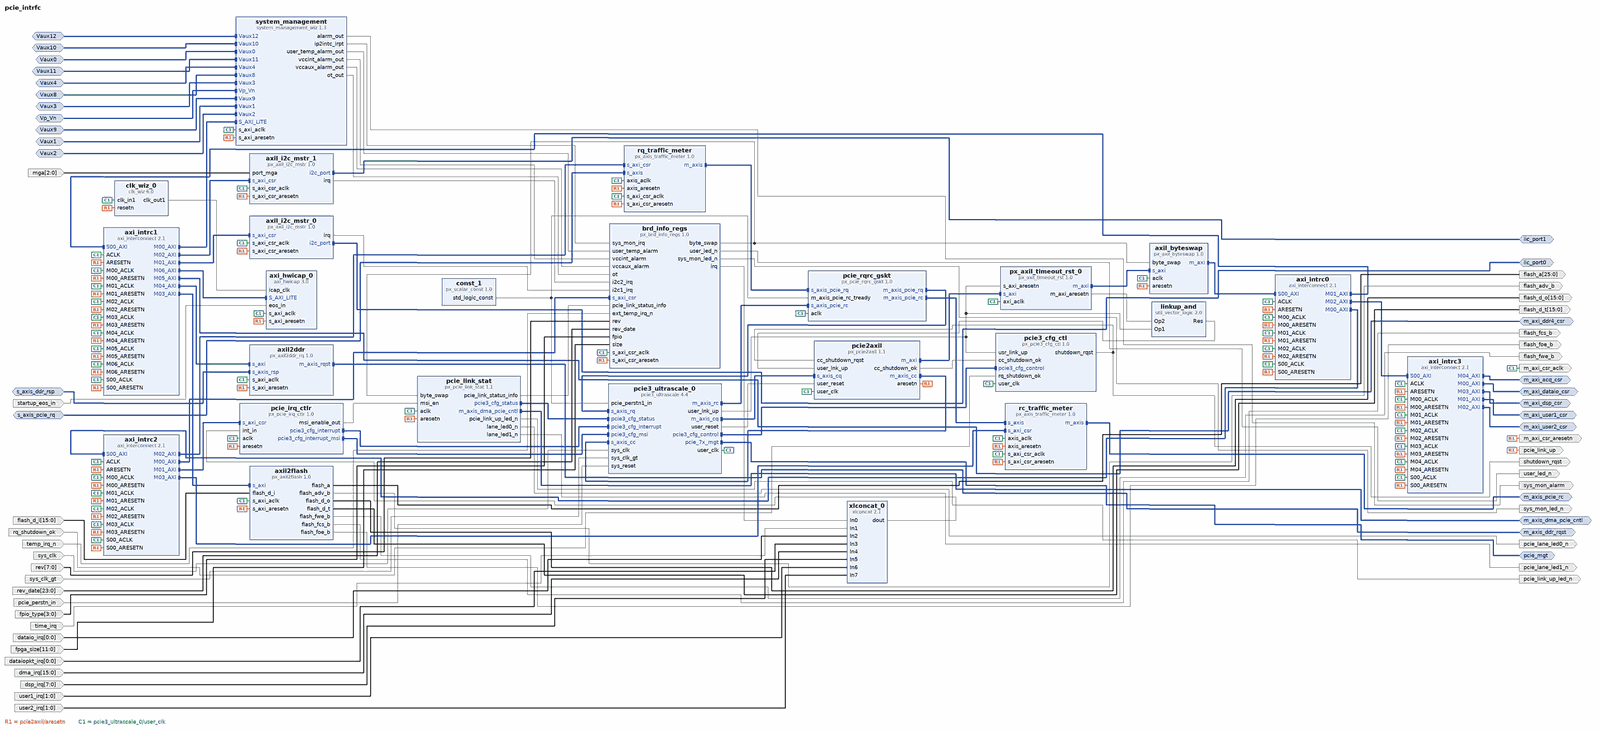
[diagram p0: block diagram of the top level, whole]
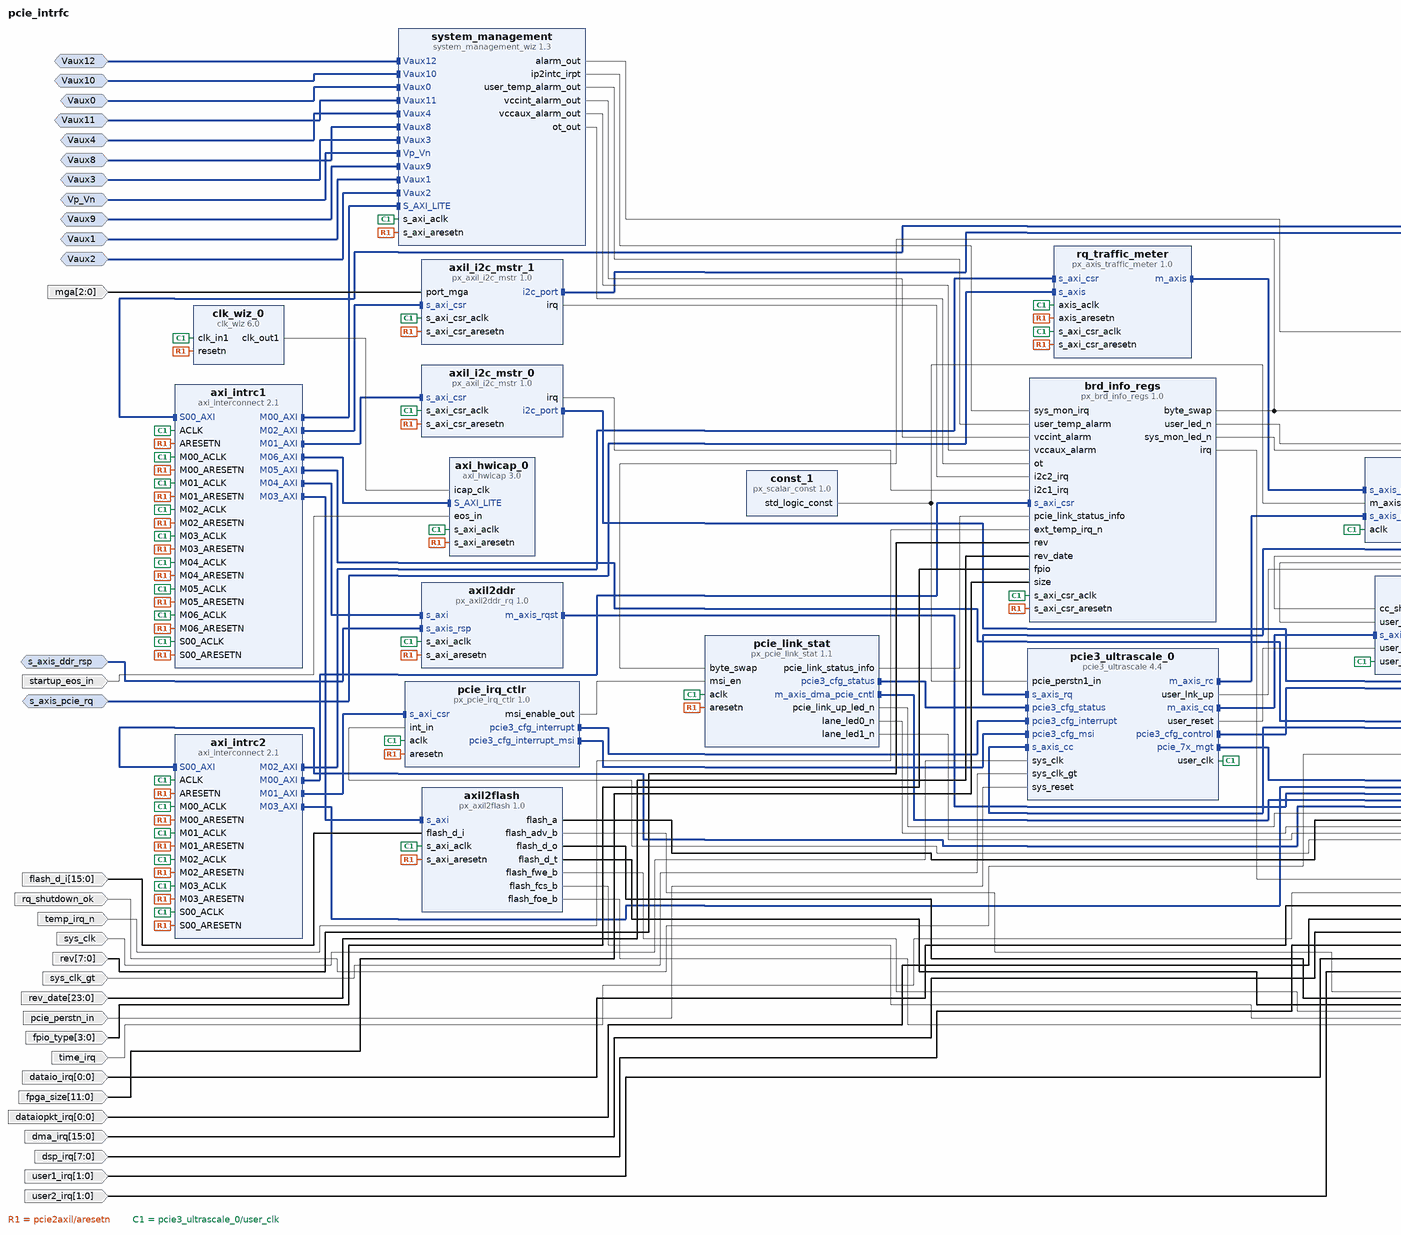
[diagram p1: block diagram of the top level, left part]
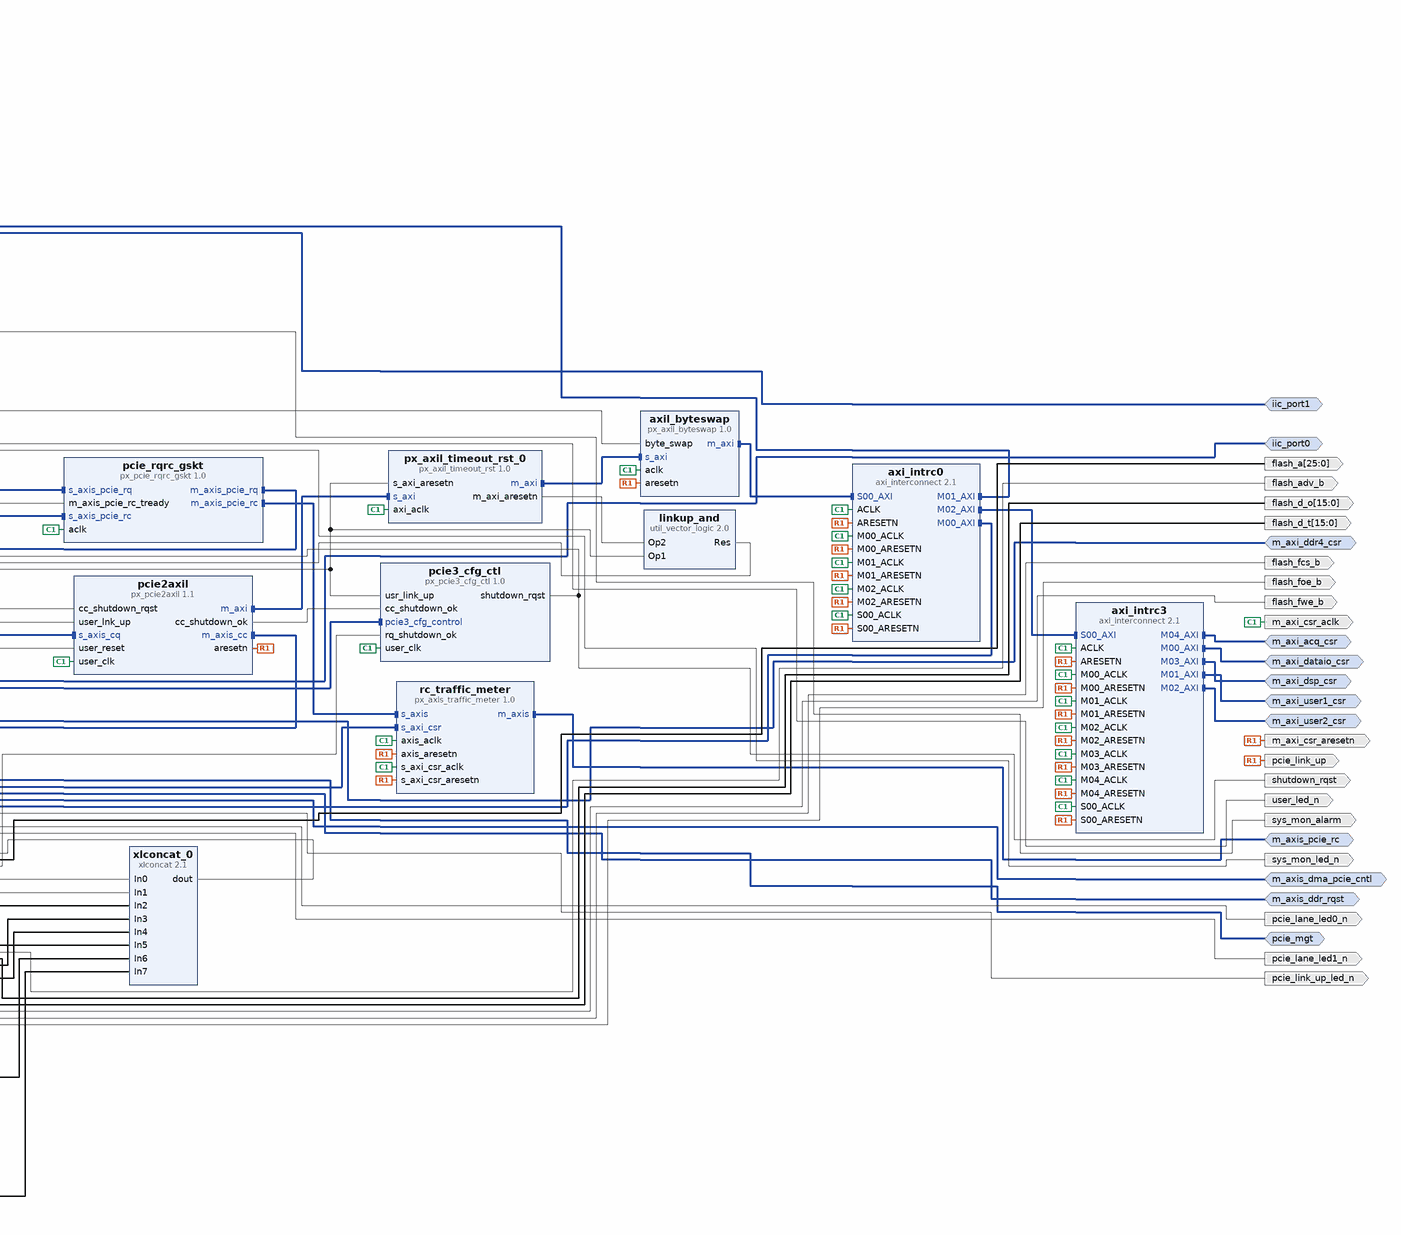
[diagram p2: block diagram of the top level, right part]
# Vivado block design pcie_intrfc, xcku060-ffva1156-2-e, Vivado 2019.2
create_bd_design pcie_intrfc

create_bd_intf_port -mode Slave -vlnv xilinx.com:interface:axis_rtl:1.0 s_axis_pcie_rq
set_property -dict [list \
  CONFIG.TDATA_NUM_BYTES 32 \
  CONFIG.TDEST_WIDTH 0 \
  CONFIG.TID_WIDTH 0 \
  CONFIG.TUSER_WIDTH 60 \
  CONFIG.HAS_TREADY 1 \
  CONFIG.HAS_TSTRB 0 \
  CONFIG.HAS_TKEEP 1 \
  CONFIG.HAS_TLAST 1 \
  CONFIG.LAYERED_METADATA undef \
] [get_bd_intf_ports s_axis_pcie_rq]
create_bd_intf_port -mode Master -vlnv xilinx.com:interface:pcie_7x_mgt_rtl:1.0 pcie_mgt
create_bd_intf_port -mode Slave -vlnv xilinx.com:interface:diff_analog_io_rtl:1.0 Vp_Vn
create_bd_intf_port -mode Slave -vlnv xilinx.com:interface:diff_analog_io_rtl:1.0 Vaux0
create_bd_intf_port -mode Slave -vlnv xilinx.com:interface:diff_analog_io_rtl:1.0 Vaux1
create_bd_intf_port -mode Slave -vlnv xilinx.com:interface:diff_analog_io_rtl:1.0 Vaux2
create_bd_intf_port -mode Slave -vlnv xilinx.com:interface:diff_analog_io_rtl:1.0 Vaux3
create_bd_intf_port -mode Slave -vlnv xilinx.com:interface:diff_analog_io_rtl:1.0 Vaux4
create_bd_intf_port -mode Slave -vlnv xilinx.com:interface:diff_analog_io_rtl:1.0 Vaux8
create_bd_intf_port -mode Slave -vlnv xilinx.com:interface:diff_analog_io_rtl:1.0 Vaux9
create_bd_intf_port -mode Slave -vlnv xilinx.com:interface:diff_analog_io_rtl:1.0 Vaux10
create_bd_intf_port -mode Slave -vlnv xilinx.com:interface:diff_analog_io_rtl:1.0 Vaux11
create_bd_intf_port -mode Slave -vlnv xilinx.com:interface:diff_analog_io_rtl:1.0 Vaux12
create_bd_intf_port -mode Master -vlnv xilinx.com:interface:iic_rtl:1.0 iic_port0
create_bd_intf_port -mode Master -vlnv xilinx.com:interface:iic_rtl:1.0 iic_port1
create_bd_intf_port -mode Master -vlnv xilinx.com:interface:axis_rtl:1.0 m_axis_dma_pcie_cntl
create_bd_intf_port -mode Master -vlnv xilinx.com:interface:aximm_rtl:1.0 m_axi_dataio_csr
set_property -dict [list \
  CONFIG.DATA_WIDTH 32 \
  CONFIG.PROTOCOL AXI4LITE \
  CONFIG.ADDR_WIDTH 26 \
  CONFIG.NUM_READ_OUTSTANDING 1 \
  CONFIG.NUM_WRITE_OUTSTANDING 1 \
] [get_bd_intf_ports m_axi_dataio_csr]
create_bd_intf_port -mode Master -vlnv xilinx.com:interface:aximm_rtl:1.0 m_axi_user1_csr
set_property -dict [list \
  CONFIG.DATA_WIDTH 32 \
  CONFIG.PROTOCOL AXI4LITE \
  CONFIG.ADDR_WIDTH 26 \
  CONFIG.NUM_READ_OUTSTANDING 1 \
  CONFIG.NUM_WRITE_OUTSTANDING 1 \
] [get_bd_intf_ports m_axi_user1_csr]
create_bd_intf_port -mode Master -vlnv xilinx.com:interface:aximm_rtl:1.0 m_axi_user2_csr
set_property -dict [list \
  CONFIG.DATA_WIDTH 32 \
  CONFIG.PROTOCOL AXI4LITE \
  CONFIG.ADDR_WIDTH 26 \
  CONFIG.NUM_READ_OUTSTANDING 1 \
  CONFIG.NUM_WRITE_OUTSTANDING 1 \
] [get_bd_intf_ports m_axi_user2_csr]
create_bd_intf_port -mode Master -vlnv xilinx.com:interface:aximm_rtl:1.0 m_axi_dsp_csr
set_property -dict [list \
  CONFIG.DATA_WIDTH 32 \
  CONFIG.PROTOCOL AXI4LITE \
  CONFIG.ADDR_WIDTH 26 \
  CONFIG.NUM_READ_OUTSTANDING 1 \
  CONFIG.NUM_WRITE_OUTSTANDING 1 \
] [get_bd_intf_ports m_axi_dsp_csr]
create_bd_intf_port -mode Master -vlnv xilinx.com:interface:aximm_rtl:1.0 m_axi_acq_csr
set_property -dict [list \
  CONFIG.DATA_WIDTH 32 \
  CONFIG.PROTOCOL AXI4LITE \
  CONFIG.ADDR_WIDTH 26 \
  CONFIG.NUM_READ_OUTSTANDING 1 \
  CONFIG.NUM_WRITE_OUTSTANDING 1 \
] [get_bd_intf_ports m_axi_acq_csr]
create_bd_intf_port -mode Master -vlnv xilinx.com:interface:axis_rtl:1.0 m_axis_ddr_rqst
create_bd_intf_port -mode Slave -vlnv xilinx.com:interface:axis_rtl:1.0 s_axis_ddr_rsp
set_property -dict [list \
  CONFIG.TDATA_NUM_BYTES 64 \
  CONFIG.TDEST_WIDTH 0 \
  CONFIG.TID_WIDTH 8 \
  CONFIG.TUSER_WIDTH 256 \
  CONFIG.HAS_TREADY 0 \
  CONFIG.HAS_TSTRB 0 \
  CONFIG.HAS_TKEEP 0 \
  CONFIG.HAS_TLAST 1 \
  CONFIG.LAYERED_METADATA undef \
] [get_bd_intf_ports s_axis_ddr_rsp]
create_bd_intf_port -mode Master -vlnv xilinx.com:interface:aximm_rtl:1.0 m_axi_ddr4_csr
set_property -dict [list \
  CONFIG.DATA_WIDTH 32 \
  CONFIG.PROTOCOL AXI4LITE \
  CONFIG.ADDR_WIDTH 26 \
  CONFIG.NUM_READ_OUTSTANDING 1 \
  CONFIG.NUM_WRITE_OUTSTANDING 1 \
] [get_bd_intf_ports m_axi_ddr4_csr]
create_bd_intf_port -mode Master -vlnv xilinx.com:interface:axis_rtl:1.0 m_axis_pcie_rc
create_bd_port -dir O pcie_link_up
create_bd_port -dir O -type rst m_axi_csr_aresetn
create_bd_port -dir O shutdown_rqst
create_bd_port -dir I rq_shutdown_ok
create_bd_port -dir O -type clk m_axi_csr_aclk
set_property -dict [list \
  CONFIG.ASSOCIATED_BUSIF s_axis_pcie_rq:m_axis_dma_pcie_cntl:m_axi_dataio_csr:m_axi_user1_csr:m_axi_user2_csr:m_axi_dsp_csr:m_axi_acq_csr:s_axis_ddr_rsp:m_axis_ddr_rqst:m_axi_ddr4_csr:m_axis_pcie_rc \
] [get_bd_ports m_axi_csr_aclk]
create_bd_port -dir I -type clk sys_clk
set_property -dict {CONFIG.FREQ_HZ 50000000} [get_bd_ports sys_clk]
create_bd_port -dir I -type clk sys_clk_gt
set_property -dict {CONFIG.FREQ_HZ 100000000} [get_bd_ports sys_clk_gt]
create_bd_port -dir I -type rst pcie_perstn_in
create_bd_port -dir O sys_mon_alarm
create_bd_port -dir I -from 2 -to 0 mga
create_bd_port -dir O pcie_link_up_led_n
create_bd_port -dir O pcie_lane_led0_n
create_bd_port -dir O pcie_lane_led1_n
create_bd_port -dir O user_led_n
create_bd_port -dir O sys_mon_led_n
create_bd_port -dir I -type intr temp_irq_n
set_property -dict {CONFIG.SENSITIVITY LEVEL_LOW} [get_bd_ports temp_irq_n]
create_bd_port -dir I -from 7 -to 0 rev
create_bd_port -dir I -from 23 -to 0 rev_date
create_bd_port -dir I -from 3 -to 0 fpio_type
create_bd_port -dir I time_irq
create_bd_port -dir I -from 0 -to 0 dataio_irq
create_bd_port -dir I -from 0 -to 0 dataiopkt_irq
create_bd_port -dir I -from 15 -to 0 dma_irq
create_bd_port -dir I -from 7 -to 0 dsp_irq
create_bd_port -dir I -from 1 -to 0 user1_irq
create_bd_port -dir I -from 1 -to 0 user2_irq
create_bd_port -dir O -from 25 -to 0 flash_a
create_bd_port -dir O flash_adv_b
create_bd_port -dir O -from 15 -to 0 flash_d_o
create_bd_port -dir O -from 15 -to 0 flash_d_t
create_bd_port -dir O flash_fwe_b
create_bd_port -dir O flash_fcs_b
create_bd_port -dir O flash_foe_b
create_bd_port -dir I -from 15 -to 0 flash_d_i
create_bd_port -dir I -from 11 -to 0 fpga_size
create_bd_port -dir I startup_eos_in

create_bd_cell -type ip -vlnv xilinx.com:ip:util_vector_logic:2.0 linkup_and
set_property -dict {CONFIG.C_SIZE 1} [get_bd_cells linkup_and]
create_bd_cell -type ip -vlnv xilinx.com:ip:xlconcat:2.1 xlconcat_0
set_property -dict [list \
  CONFIG.IN0_WIDTH 1 \
  CONFIG.IN1_WIDTH 1 \
  CONFIG.IN2_WIDTH 1 \
  CONFIG.IN3_WIDTH 1 \
  CONFIG.IN4_WIDTH 16 \
  CONFIG.IN5_WIDTH 8 \
  CONFIG.IN6_WIDTH 2 \
  CONFIG.IN7_WIDTH 2 \
  CONFIG.NUM_PORTS 8 \
  CONFIG.dout_width 32 \
] [get_bd_cells xlconcat_0]
create_bd_cell -type ip -vlnv xilinx.com:ip:axi_hwicap:3.0 axi_hwicap_0
create_bd_cell -type ip -vlnv xilinx.com:ip:axi_interconnect:2.1 axi_intrc0
set_property -dict [list \
  CONFIG.M00_HAS_REGSLICE 3 \
  CONFIG.M01_HAS_REGSLICE 3 \
  CONFIG.M02_HAS_REGSLICE 1 \
  CONFIG.NUM_MI 3 \
  CONFIG.S00_HAS_REGSLICE 1 \
  CONFIG.SYNCHRONIZATION_STAGES 2 \
] [get_bd_cells axi_intrc0]
create_bd_cell -type ip -vlnv xilinx.com:ip:axi_interconnect:2.1 axi_intrc2
set_property -dict [list \
  CONFIG.M00_HAS_REGSLICE 3 \
  CONFIG.M01_HAS_REGSLICE 3 \
  CONFIG.M02_HAS_REGSLICE 3 \
  CONFIG.M03_HAS_REGSLICE 3 \
  CONFIG.NUM_MI 4 \
  CONFIG.S00_HAS_REGSLICE 1 \
  CONFIG.SYNCHRONIZATION_STAGES 2 \
] [get_bd_cells axi_intrc2]
create_bd_cell -type ip -vlnv xilinx.com:ip:axi_interconnect:2.1 axi_intrc1
set_property -dict [list \
  CONFIG.M00_HAS_REGSLICE 3 \
  CONFIG.M01_HAS_REGSLICE 3 \
  CONFIG.M02_HAS_REGSLICE 3 \
  CONFIG.M03_HAS_REGSLICE 3 \
  CONFIG.M04_HAS_REGSLICE 3 \
  CONFIG.M05_HAS_REGSLICE 3 \
  CONFIG.M06_HAS_REGSLICE 3 \
  CONFIG.NUM_MI 7 \
  CONFIG.S00_HAS_REGSLICE 1 \
  CONFIG.SYNCHRONIZATION_STAGES 2 \
] [get_bd_cells axi_intrc1]
create_bd_cell -type ip -vlnv xilinx.com:ip:axi_interconnect:2.1 axi_intrc3
set_property -dict [list \
  CONFIG.M00_HAS_REGSLICE 3 \
  CONFIG.M01_HAS_REGSLICE 3 \
  CONFIG.M02_HAS_REGSLICE 3 \
  CONFIG.M03_HAS_REGSLICE 3 \
  CONFIG.M04_HAS_REGSLICE 3 \
  CONFIG.NUM_MI 5 \
  CONFIG.S00_HAS_REGSLICE 1 \
  CONFIG.SYNCHRONIZATION_STAGES 2 \
] [get_bd_cells axi_intrc3]
create_bd_cell -type ip -vlnv xilinx.com:ip:clk_wiz:6.0 clk_wiz_0
set_property -dict [list \
  CONFIG.CLKIN1_JITTER_PS 40.0 \
  CONFIG.CLKOUT1_DRIVES BUFGCE \
  CONFIG.CLKOUT1_JITTER 198.840 \
  CONFIG.CLKOUT1_PHASE_ERROR 145.783 \
  CONFIG.CLKOUT1_REQUESTED_OUT_FREQ 62.5 \
  CONFIG.CLKOUT2_DRIVES BUFGCE \
  CONFIG.CLKOUT3_DRIVES BUFGCE \
  CONFIG.CLKOUT4_DRIVES BUFGCE \
  CONFIG.CLKOUT5_DRIVES BUFGCE \
  CONFIG.CLKOUT6_DRIVES BUFGCE \
  CONFIG.CLKOUT7_DRIVES BUFGCE \
  CONFIG.FEEDBACK_SOURCE FDBK_AUTO \
  CONFIG.JITTER_SEL No_Jitter \
  CONFIG.MMCM_CLKFBOUT_MULT_F 9.625 \
  CONFIG.MMCM_CLKIN1_PERIOD 4.000 \
  CONFIG.MMCM_CLKIN2_PERIOD 10.0 \
  CONFIG.MMCM_CLKOUT0_DIVIDE_F 9.625 \
  CONFIG.MMCM_CLKOUT0_DUTY_CYCLE 0.5 \
  CONFIG.MMCM_DIVCLK_DIVIDE 4 \
  CONFIG.PRIM_IN_FREQ 250 \
  CONFIG.RESET_PORT resetn \
  CONFIG.RESET_TYPE ACTIVE_LOW \
  CONFIG.SECONDARY_SOURCE Single_ended_clock_capable_pin \
  CONFIG.USE_LOCKED false \
  CONFIG.USE_MIN_POWER true \
  CONFIG.USE_PHASE_ALIGNMENT false \
  CONFIG.USE_SAFE_CLOCK_STARTUP true \
] [get_bd_cells clk_wiz_0]
create_bd_cell -type ip -vlnv xilinx.com:ip:pcie3_ultrascale:4.4 pcie3_ultrascale_0
set_property -dict [list \
  CONFIG.AXISTEN_IF_RC_STRADDLE false \
  CONFIG.INS_LOSS_NYQ 15 \
  CONFIG.PF0_DEVICE_ID 7182 \
  CONFIG.PF0_MSIX_CAP_PBA_BIR BAR_1:0 \
  CONFIG.PF0_MSIX_CAP_TABLE_BIR BAR_1:0 \
  CONFIG.PF0_SUBSYSTEM_ID 300 \
  CONFIG.PF1_DEVICE_ID 8011 \
  CONFIG.PF1_MSIX_CAP_PBA_BIR BAR_0 \
  CONFIG.PF1_MSIX_CAP_TABLE_BIR BAR_0 \
  CONFIG.PL_LINK_CAP_MAX_LINK_SPEED 8.0_GT/s \
  CONFIG.PL_LINK_CAP_MAX_LINK_WIDTH X8 \
  CONFIG.REF_CLK_FREQ 100_MHz \
  CONFIG.alignment_mode Address_Aligned \
  CONFIG.aspm_support No_ASPM \
  CONFIG.axisten_freq 250 \
  CONFIG.axisten_if_width 256_bit \
  CONFIG.cfg_ext_if false \
  CONFIG.cfg_fc_if false \
  CONFIG.cfg_mgmt_if false \
  CONFIG.cfg_tx_msg_if false \
  CONFIG.coreclk_freq 500 \
  CONFIG.enable_auto_rxeq True \
  CONFIG.ins_loss_profile Add-in_Card \
  CONFIG.mode_selection Advanced \
  CONFIG.mult_pf_des false \
  CONFIG.per_func_status_if false \
  CONFIG.pf0_bar0_64bit true \
  CONFIG.pf0_bar0_scale Megabytes \
  CONFIG.pf0_bar0_size 64 \
  CONFIG.pf0_base_class_menu Data_acquisition_and_signal_processing_controllers \
  CONFIG.pf0_sub_class_interface_menu Other_data_acquisition/signal_processing_controllers \
  CONFIG.pf1_base_class_menu Simple_communication_controllers \
  CONFIG.pf1_sub_class_interface_menu Generic_XT_compatible_serial_controller \
  CONFIG.plltype QPLL1 \
  CONFIG.rcv_msg_if false \
  CONFIG.tx_fc_if false \
  CONFIG.vendor_id 12f0 \
] [get_bd_cells pcie3_ultrascale_0]
create_bd_cell -type ip -vlnv pentek.com:px_ip:px_axil2ddr_rq:1.0 axil2ddr
set_property -dict {CONFIG.has_irq false} [get_bd_cells axil2ddr]
create_bd_cell -type ip -vlnv pentek.com:px_ip:px_axil2flash:1.0 axil2flash
set_property -dict {CONFIG.flash_addr_bits 26} [get_bd_cells axil2flash]
create_bd_cell -type ip -vlnv pentek.com:px_ip:px_axil_byteswap:1.0 axil_byteswap
set_property -dict {CONFIG.addr_width 26} [get_bd_cells axil_byteswap]
create_bd_cell -type ip -vlnv pentek.com:px_ip:px_axil_i2c_mstr:1.0 axil_i2c_mstr_0
set_property -dict {CONFIG.port_has_mga false} [get_bd_cells axil_i2c_mstr_0]
create_bd_cell -type ip -vlnv pentek.com:px_ip:px_axil_i2c_mstr:1.0 axil_i2c_mstr_1
create_bd_cell -type ip -vlnv pentek.com:px_ip:px_axil_timeout_rst:1.0 px_axil_timeout_rst_0
set_property -dict {CONFIG.addr_bits 26} [get_bd_cells px_axil_timeout_rst_0]
create_bd_cell -type ip -vlnv pentek.com:px_ip:px_axis_traffic_meter:1.0 rq_traffic_meter
set_property -dict {CONFIG.div_factor 2 CONFIG.num_bytes 32 CONFIG.tuser_size 60} [get_bd_cells rq_traffic_meter]
create_bd_cell -type ip -vlnv pentek.com:px_ip:px_brd_info_regs:1.0 brd_info_regs
set_property -dict [list \
  CONFIG.board_id 0x7182 \
  CONFIG.fpga_code_id 0x71821 \
  CONFIG.has_fpga_size_in true \
  CONFIG.has_rev_info_in true \
  CONFIG.has_user1_irq false \
  CONFIG.has_user2_irq false \
  CONFIG.has_user3_irq false \
  CONFIG.has_user4_irq false \
  CONFIG.has_user5_irq false \
  CONFIG.has_user6_irq false \
  CONFIG.has_user7_irq false \
  CONFIG.has_user8_irq false \
  CONFIG.user_word 0x58524348 \
] [get_bd_cells brd_info_regs]
create_bd_cell -type ip -vlnv pentek.com:px_ip:px_pcie2axil:1.1 pcie2axil
set_property -dict [list \
  CONFIG.bar0_size_bits 26 \
  CONFIG.bar1_addr_translation 0x00000000 \
  CONFIG.bar1_size_bits 26 \
  CONFIG.bar2_addr_translation 0x00000000 \
  CONFIG.bar2_size_bits 26 \
  CONFIG.bar3_addr_translation 0x00000000 \
  CONFIG.bar3_size_bits 26 \
  CONFIG.bar4_addr_translation 0x00000000 \
  CONFIG.bar4_size_bits 26 \
  CONFIG.bar5_addr_translation 0x00000000 \
  CONFIG.bar5_size_bits 26 \
  CONFIG.num_addr_bits 26 \
] [get_bd_cells pcie2axil]
create_bd_cell -type ip -vlnv pentek.com:px_ip:px_pcie3_cfg_ctl:1.0 pcie3_cfg_ctl
set_property -dict {CONFIG.subsys_vend_id 0x10EE} [get_bd_cells pcie3_cfg_ctl]
create_bd_cell -type ip -vlnv pentek.com:px_ip:px_pcie_irq_ctlr:1.0 pcie_irq_ctlr
set_property -dict {CONFIG.ku 1} [get_bd_cells pcie_irq_ctlr]
create_bd_cell -type ip -vlnv pentek.com:px_ip:px_pcie_link_stat:1.1 pcie_link_stat
create_bd_cell -type ip -vlnv pentek.com:px_ip:px_pcie_rqrc_gskt:1.0 pcie_rqrc_gskt
create_bd_cell -type ip -vlnv pentek.com:px_ip:px_scalar_const:1.0 const_1
set_property -dict {CONFIG.value {"1"}} [get_bd_cells const_1]
create_bd_cell -type ip -vlnv pentek.com:px_ip:px_axis_traffic_meter:1.0 rc_traffic_meter
set_property -dict {CONFIG.div_factor 2 CONFIG.num_bytes 32 CONFIG.tuser_size 75} [get_bd_cells rc_traffic_meter]
create_bd_cell -type ip -vlnv xilinx.com:ip:system_management_wiz:1.3 system_management
set_property -dict [list \
  CONFIG.ADC_CONVERSION_RATE 200.0 \
  CONFIG.ADC_OFFSET_CALIBRATION false \
  CONFIG.ANALOG_BANK_SELECTION 48 \
  CONFIG.AVERAGE_ENABLE_TEMPERATURE true \
  CONFIG.AVERAGE_ENABLE_VAUXP0_VAUXN0 true \
  CONFIG.AVERAGE_ENABLE_VAUXP10_VAUXN10 true \
  CONFIG.AVERAGE_ENABLE_VAUXP11_VAUXN11 true \
  CONFIG.AVERAGE_ENABLE_VAUXP12_VAUXN12 true \
  CONFIG.AVERAGE_ENABLE_VAUXP1_VAUXN1 true \
  CONFIG.AVERAGE_ENABLE_VAUXP2_VAUXN2 true \
  CONFIG.AVERAGE_ENABLE_VAUXP3_VAUXN3 true \
  CONFIG.AVERAGE_ENABLE_VAUXP4_VAUXN4 true \
  CONFIG.AVERAGE_ENABLE_VAUXP8_VAUXN8 true \
  CONFIG.AVERAGE_ENABLE_VAUXP9_VAUXN9 true \
  CONFIG.AVERAGE_ENABLE_VBRAM true \
  CONFIG.AVERAGE_ENABLE_VCCAUX true \
  CONFIG.AVERAGE_ENABLE_VCCINT true \
  CONFIG.AVERAGE_ENABLE_VP_VN true \
  CONFIG.CHANNEL_ENABLE_VAUXP0_VAUXN0 true \
  CONFIG.CHANNEL_ENABLE_VAUXP10_VAUXN10 true \
  CONFIG.CHANNEL_ENABLE_VAUXP11_VAUXN11 true \
  CONFIG.CHANNEL_ENABLE_VAUXP12_VAUXN12 true \
  CONFIG.CHANNEL_ENABLE_VAUXP1_VAUXN1 true \
  CONFIG.CHANNEL_ENABLE_VAUXP2_VAUXN2 true \
  CONFIG.CHANNEL_ENABLE_VAUXP3_VAUXN3 true \
  CONFIG.CHANNEL_ENABLE_VAUXP4_VAUXN4 true \
  CONFIG.CHANNEL_ENABLE_VAUXP8_VAUXN8 true \
  CONFIG.CHANNEL_ENABLE_VAUXP9_VAUXN9 true \
  CONFIG.CHANNEL_ENABLE_VP_VN true \
  CONFIG.DCLK_FREQUENCY 250 \
  CONFIG.I2C_SCLK_LOC AE12 \
  CONFIG.I2C_SDA_LOC AF12 \
  CONFIG.INTERFACE_SELECTION Enable_AXI \
  CONFIG.VAUXN0_LOC Y32 \
  CONFIG.VAUXN10_LOC AB34 \
  CONFIG.VAUXN11_LOC AD34 \
  CONFIG.VAUXN12_LOC AF32 \
  CONFIG.VAUXN13_LOC AG32 \
  CONFIG.VAUXN14_LOC AE30 \
  CONFIG.VAUXN15_LOC AD28 \
  CONFIG.VAUXN1_LOC Y30 \
  CONFIG.VAUXN2_LOC AD33 \
  CONFIG.VAUXN3_LOC AB29 \
  CONFIG.VAUXN4_LOC AF34 \
  CONFIG.VAUXN5_LOC AG34 \
  CONFIG.VAUXN6_LOC AG30 \
  CONFIG.VAUXN7_LOC AG29 \
  CONFIG.VAUXN8_LOC W34 \
  CONFIG.VAUXN9_LOC Y33 \
  CONFIG.VAUXP0_LOC Y31 \
  CONFIG.VAUXP10_LOC AA34 \
  CONFIG.VAUXP11_LOC AC34 \
  CONFIG.VAUXP12_LOC AE32 \
  CONFIG.VAUXP13_LOC AG31 \
  CONFIG.VAUXP14_LOC AD29 \
  CONFIG.VAUXP15_LOC AC28 \
  CONFIG.VAUXP1_LOC W30 \
  CONFIG.VAUXP2_LOC AC33 \
  CONFIG.VAUXP3_LOC AA29 \
  CONFIG.VAUXP4_LOC AE33 \
  CONFIG.VAUXP5_LOC AF33 \
  CONFIG.VAUXP6_LOC AF30 \
  CONFIG.VAUXP7_LOC AF29 \
  CONFIG.VAUXP8_LOC V33 \
  CONFIG.VAUXP9_LOC W33 \
] [get_bd_cells system_management]

# ---- connections ----

connect_bd_intf_net [get_bd_intf_ports m_axis_dma_pcie_cntl] [get_bd_intf_pins pcie_link_stat/m_axis_dma_pcie_cntl]
connect_bd_intf_net -intf_net Vaux12_1 [get_bd_intf_ports Vaux12] [get_bd_intf_pins system_management/Vaux12]
connect_bd_intf_net [get_bd_intf_pins pcie_rqrc_gskt/m_axis_pcie_rq] [get_bd_intf_pins pcie3_ultrascale_0/s_axis_rq]
connect_bd_intf_net [get_bd_intf_pins pcie_rqrc_gskt/s_axis_pcie_rc] [get_bd_intf_pins pcie3_ultrascale_0/m_axis_rc]
connect_bd_intf_net [get_bd_intf_pins axi_intrc1/M06_AXI] [get_bd_intf_pins axi_hwicap_0/S_AXI_LITE]
connect_bd_intf_net [get_bd_intf_pins pcie_rqrc_gskt/s_axis_pcie_rq] [get_bd_intf_pins rq_traffic_meter/m_axis]
connect_bd_intf_net [get_bd_intf_pins axi_intrc2/M00_AXI] [get_bd_intf_pins brd_info_regs/s_axi_csr]
connect_bd_intf_net [get_bd_intf_pins axi_intrc2/M03_AXI] [get_bd_intf_pins rc_traffic_meter/s_axi_csr]
connect_bd_intf_net [get_bd_intf_pins axil_byteswap/m_axi] [get_bd_intf_pins axi_intrc0/S00_AXI]
connect_bd_intf_net -intf_net px_pcie3_cfg_ctl_0_pcie3_cfg_control [get_bd_intf_pins pcie3_ultrascale_0/pcie3_cfg_control] [get_bd_intf_pins pcie3_cfg_ctl/pcie3_cfg_control]
connect_bd_intf_net [get_bd_intf_pins axi_intrc2/M01_AXI] [get_bd_intf_pins pcie_irq_ctlr/s_axi_csr]
connect_bd_intf_net [get_bd_intf_pins pcie_link_stat/pcie3_cfg_status] [get_bd_intf_pins pcie3_ultrascale_0/pcie3_cfg_status]
connect_bd_intf_net [get_bd_intf_pins axi_intrc1/M04_AXI] [get_bd_intf_pins axil2ddr/s_axi]
connect_bd_intf_net [get_bd_intf_pins axi_intrc0/M00_AXI] [get_bd_intf_pins axi_intrc2/S00_AXI]
connect_bd_intf_net [get_bd_intf_pins pcie3_ultrascale_0/m_axis_cq] [get_bd_intf_pins pcie2axil/s_axis_cq]
connect_bd_intf_net [get_bd_intf_pins axi_intrc3/S00_AXI] [get_bd_intf_pins axi_intrc0/M02_AXI]
connect_bd_intf_net -intf_net rc_traffic_meter1_m_axis [get_bd_intf_ports m_axis_pcie_rc] [get_bd_intf_pins rc_traffic_meter/m_axis]
connect_bd_intf_net -intf_net axi_interconnect_0_M00_AXI [get_bd_intf_pins axi_intrc1/M00_AXI] [get_bd_intf_pins system_management/S_AXI_LITE]
connect_bd_intf_net [get_bd_intf_pins rc_traffic_meter/s_axis] [get_bd_intf_pins pcie_rqrc_gskt/m_axis_pcie_rc]
connect_bd_intf_net -intf_net axi_interconnect_0_M02_AXI [get_bd_intf_pins axi_intrc1/M02_AXI] [get_bd_intf_pins axil_i2c_mstr_1/s_axi_csr]
connect_bd_intf_net -intf_net axi_interconnect_0_M01_AXI [get_bd_intf_pins axi_intrc1/M01_AXI] [get_bd_intf_pins axil_i2c_mstr_0/s_axi_csr]
connect_bd_intf_net [get_bd_intf_pins axil2flash/s_axi] [get_bd_intf_pins axi_intrc1/M03_AXI]
connect_bd_intf_net [get_bd_intf_pins pcie_irq_ctlr/pcie3_cfg_interrupt] [get_bd_intf_pins pcie3_ultrascale_0/pcie3_cfg_interrupt]
connect_bd_intf_net [get_bd_intf_pins pcie2axil/m_axis_cc] [get_bd_intf_pins pcie3_ultrascale_0/s_axis_cc]
connect_bd_intf_net -intf_net axi_interconnect_0_M03_AXI [get_bd_intf_ports m_axi_dsp_csr] [get_bd_intf_pins axi_intrc3/M03_AXI]
connect_bd_intf_net [get_bd_intf_ports m_axi_acq_csr] [get_bd_intf_pins axi_intrc3/M04_AXI]
connect_bd_intf_net [get_bd_intf_ports pcie_mgt] [get_bd_intf_pins pcie3_ultrascale_0/pcie_7x_mgt]
connect_bd_intf_net -intf_net Vaux10_1 [get_bd_intf_ports Vaux10] [get_bd_intf_pins system_management/Vaux10]
connect_bd_intf_net -intf_net Vaux0_1 [get_bd_intf_ports Vaux0] [get_bd_intf_pins system_management/Vaux0]
connect_bd_intf_net [get_bd_intf_pins pcie2axil/m_axi] [get_bd_intf_pins px_axil_timeout_rst_0/s_axi]
connect_bd_intf_net [get_bd_intf_ports m_axi_ddr4_csr] [get_bd_intf_pins axi_intrc1/M05_AXI]
connect_bd_intf_net -intf_net Vaux11_1 [get_bd_intf_ports Vaux11] [get_bd_intf_pins system_management/Vaux11]
connect_bd_intf_net [get_bd_intf_pins pcie_irq_ctlr/pcie3_cfg_interrupt_msi] [get_bd_intf_pins pcie3_ultrascale_0/pcie3_cfg_msi]
connect_bd_intf_net [get_bd_intf_pins axi_intrc2/M02_AXI] [get_bd_intf_pins rq_traffic_meter/s_axi_csr]
connect_bd_intf_net [get_bd_intf_pins axi_intrc0/M01_AXI] [get_bd_intf_pins axi_intrc1/S00_AXI]
connect_bd_intf_net -intf_net axi_interconnect_0_M01_AXI1 [get_bd_intf_ports m_axi_user1_csr] [get_bd_intf_pins axi_intrc3/M01_AXI]
connect_bd_intf_net -intf_net axi_interconnect_0_M02_AXI1 [get_bd_intf_ports m_axi_user2_csr] [get_bd_intf_pins axi_intrc3/M02_AXI]
connect_bd_intf_net -intf_net Vaux4_1 [get_bd_intf_ports Vaux4] [get_bd_intf_pins system_management/Vaux4]
connect_bd_intf_net -intf_net Vaux8_1 [get_bd_intf_ports Vaux8] [get_bd_intf_pins system_management/Vaux8]
connect_bd_intf_net [get_bd_intf_ports iic_port1] [get_bd_intf_pins axil_i2c_mstr_1/i2c_port]
connect_bd_intf_net -intf_net axi_interconnect_0_M00_AXI1 [get_bd_intf_ports m_axi_dataio_csr] [get_bd_intf_pins axi_intrc3/M00_AXI]
connect_bd_intf_net [get_bd_intf_ports s_axis_ddr_rsp] [get_bd_intf_pins axil2ddr/s_axis_rsp]
connect_bd_intf_net [get_bd_intf_ports iic_port0] [get_bd_intf_pins axil_i2c_mstr_0/i2c_port]
connect_bd_intf_net -intf_net Vaux3_1 [get_bd_intf_ports Vaux3] [get_bd_intf_pins system_management/Vaux3]
connect_bd_intf_net [get_bd_intf_ports Vp_Vn] [get_bd_intf_pins system_management/Vp_Vn]
connect_bd_intf_net -intf_net px_axil2ddr_rq_0_m_axis_rqst [get_bd_intf_ports m_axis_ddr_rqst] [get_bd_intf_pins axil2ddr/m_axis_rqst]
connect_bd_intf_net -intf_net Vaux9_1 [get_bd_intf_ports Vaux9] [get_bd_intf_pins system_management/Vaux9]
connect_bd_intf_net -intf_net Vaux1_1 [get_bd_intf_ports Vaux1] [get_bd_intf_pins system_management/Vaux1]
connect_bd_intf_net -intf_net Vaux2_1 [get_bd_intf_ports Vaux2] [get_bd_intf_pins system_management/Vaux2]
connect_bd_intf_net [get_bd_intf_ports s_axis_pcie_rq] [get_bd_intf_pins rq_traffic_meter/s_axis]
connect_bd_intf_net [get_bd_intf_pins px_axil_timeout_rst_0/m_axi] [get_bd_intf_pins axil_byteswap/s_axi]
connect_bd_net [get_bd_pins pcie2axil/aresetn] \
  [get_bd_ports m_axi_csr_aresetn] [get_bd_ports pcie_link_up] [get_bd_pins axi_hwicap_0/s_axi_aresetn] \
  [get_bd_pins axi_intrc0/ARESETN] [get_bd_pins axi_intrc0/S00_ARESETN] [get_bd_pins axi_intrc0/M00_ARESETN] \
  [get_bd_pins axi_intrc0/M01_ARESETN] [get_bd_pins axi_intrc0/M02_ARESETN] [get_bd_pins axi_intrc2/ARESETN] \
  [get_bd_pins axi_intrc2/S00_ARESETN] [get_bd_pins axi_intrc2/M00_ARESETN] [get_bd_pins axi_intrc2/M01_ARESETN] \
  [get_bd_pins axi_intrc2/M02_ARESETN] [get_bd_pins axi_intrc2/M03_ARESETN] [get_bd_pins axi_intrc1/ARESETN] \
  [get_bd_pins axi_intrc1/S00_ARESETN] [get_bd_pins axi_intrc1/M00_ARESETN] [get_bd_pins axi_intrc1/M01_ARESETN] \
  [get_bd_pins axi_intrc1/M02_ARESETN] [get_bd_pins axi_intrc1/M03_ARESETN] [get_bd_pins axi_intrc1/M04_ARESETN] \
  [get_bd_pins axi_intrc1/M05_ARESETN] [get_bd_pins axi_intrc1/M06_ARESETN] [get_bd_pins axi_intrc3/ARESETN] \
  [get_bd_pins axi_intrc3/S00_ARESETN] [get_bd_pins axi_intrc3/M00_ARESETN] [get_bd_pins axi_intrc3/M01_ARESETN] \
  [get_bd_pins axi_intrc3/M02_ARESETN] [get_bd_pins axi_intrc3/M03_ARESETN] [get_bd_pins axi_intrc3/M04_ARESETN] \
  [get_bd_pins clk_wiz_0/resetn] [get_bd_pins axil2ddr/s_axi_aresetn] [get_bd_pins axil2flash/s_axi_aresetn] \
  [get_bd_pins axil_byteswap/aresetn] [get_bd_pins axil_i2c_mstr_0/s_axi_csr_aresetn] \
  [get_bd_pins axil_i2c_mstr_1/s_axi_csr_aresetn] [get_bd_pins rq_traffic_meter/s_axi_csr_aresetn] \
  [get_bd_pins rq_traffic_meter/axis_aresetn] [get_bd_pins brd_info_regs/s_axi_csr_aresetn] \
  [get_bd_pins pcie_irq_ctlr/aresetn] [get_bd_pins pcie_link_stat/aresetn] [get_bd_pins rc_traffic_meter/s_axi_csr_aresetn] \
  [get_bd_pins rc_traffic_meter/axis_aresetn] [get_bd_pins system_management/s_axi_aresetn]
connect_bd_net [get_bd_pins pcie3_ultrascale_0/user_reset] [get_bd_pins pcie2axil/user_reset]
connect_bd_net [get_bd_pins pcie3_ultrascale_0/user_lnk_up] \
  [get_bd_pins linkup_and/Op1] [get_bd_pins px_axil_timeout_rst_0/s_axi_aresetn] [get_bd_pins pcie3_cfg_ctl/usr_link_up]
connect_bd_net -net px_pcie3_cfg_ctl_0_shutdown_rqst [get_bd_pins pcie3_cfg_ctl/shutdown_rqst] \
  [get_bd_ports shutdown_rqst] [get_bd_pins pcie2axil/cc_shutdown_rqst]
connect_bd_net [get_bd_pins pcie2axil/cc_shutdown_ok] [get_bd_pins pcie3_cfg_ctl/cc_shutdown_ok]
connect_bd_net [get_bd_ports rq_shutdown_ok] [get_bd_pins pcie3_cfg_ctl/rq_shutdown_ok]
connect_bd_net [get_bd_pins pcie3_ultrascale_0/user_clk] \
  [get_bd_ports m_axi_csr_aclk] [get_bd_pins axi_hwicap_0/s_axi_aclk] [get_bd_pins axi_intrc0/ACLK] \
  [get_bd_pins axi_intrc0/S00_ACLK] [get_bd_pins axi_intrc0/M00_ACLK] [get_bd_pins axi_intrc0/M01_ACLK] \
  [get_bd_pins axi_intrc0/M02_ACLK] [get_bd_pins axi_intrc2/ACLK] [get_bd_pins axi_intrc2/S00_ACLK] \
  [get_bd_pins axi_intrc2/M00_ACLK] [get_bd_pins axi_intrc2/M01_ACLK] [get_bd_pins axi_intrc2/M02_ACLK] \
  [get_bd_pins axi_intrc2/M03_ACLK] [get_bd_pins axi_intrc1/ACLK] [get_bd_pins axi_intrc1/S00_ACLK] \
  [get_bd_pins axi_intrc1/M00_ACLK] [get_bd_pins axi_intrc1/M01_ACLK] [get_bd_pins axi_intrc1/M02_ACLK] \
  [get_bd_pins axi_intrc1/M03_ACLK] [get_bd_pins axi_intrc1/M04_ACLK] [get_bd_pins axi_intrc1/M05_ACLK] \
  [get_bd_pins axi_intrc1/M06_ACLK] [get_bd_pins axi_intrc3/ACLK] [get_bd_pins axi_intrc3/S00_ACLK] \
  [get_bd_pins axi_intrc3/M00_ACLK] [get_bd_pins axi_intrc3/M01_ACLK] [get_bd_pins axi_intrc3/M02_ACLK] \
  [get_bd_pins axi_intrc3/M03_ACLK] [get_bd_pins axi_intrc3/M04_ACLK] [get_bd_pins clk_wiz_0/clk_in1] \
  [get_bd_pins axil2ddr/s_axi_aclk] [get_bd_pins axil2flash/s_axi_aclk] [get_bd_pins axil_byteswap/aclk] \
  [get_bd_pins axil_i2c_mstr_0/s_axi_csr_aclk] [get_bd_pins axil_i2c_mstr_1/s_axi_csr_aclk] \
  [get_bd_pins px_axil_timeout_rst_0/axi_aclk] [get_bd_pins rq_traffic_meter/s_axi_csr_aclk] \
  [get_bd_pins rq_traffic_meter/axis_aclk] [get_bd_pins brd_info_regs/s_axi_csr_aclk] [get_bd_pins pcie2axil/user_clk] \
  [get_bd_pins pcie3_cfg_ctl/user_clk] [get_bd_pins pcie_irq_ctlr/aclk] [get_bd_pins pcie_link_stat/aclk] \
  [get_bd_pins pcie_rqrc_gskt/aclk] [get_bd_pins rc_traffic_meter/s_axi_csr_aclk] [get_bd_pins rc_traffic_meter/axis_aclk] \
  [get_bd_pins system_management/s_axi_aclk]
connect_bd_net [get_bd_pins pcie_irq_ctlr/msi_enable_out] [get_bd_pins pcie_link_stat/msi_en]
connect_bd_net [get_bd_pins brd_info_regs/byte_swap] [get_bd_pins axil_byteswap/byte_swap] [get_bd_pins pcie_link_stat/byte_swap]
connect_bd_net [get_bd_ports sys_clk] [get_bd_pins pcie3_ultrascale_0/sys_clk]
connect_bd_net [get_bd_ports sys_clk_gt] [get_bd_pins pcie3_ultrascale_0/sys_clk_gt]
connect_bd_net -net sys_reset_1 [get_bd_ports pcie_perstn_in] [get_bd_pins pcie3_ultrascale_0/sys_reset]
connect_bd_net -net px_scalar_const_0_std_logic_const [get_bd_pins const_1/std_logic_const] \
  [get_bd_pins pcie3_ultrascale_0/pcie_perstn1_in] [get_bd_pins pcie_rqrc_gskt/m_axis_pcie_rc_tready]
connect_bd_net [get_bd_pins system_management/ip2intc_irpt] [get_bd_pins brd_info_regs/sys_mon_irq]
connect_bd_net [get_bd_pins system_management/user_temp_alarm_out] [get_bd_pins brd_info_regs/user_temp_alarm]
connect_bd_net [get_bd_pins system_management/vccint_alarm_out] [get_bd_pins brd_info_regs/vccint_alarm]
connect_bd_net [get_bd_pins system_management/vccaux_alarm_out] [get_bd_pins brd_info_regs/vccaux_alarm]
connect_bd_net [get_bd_pins system_management/ot_out] [get_bd_pins brd_info_regs/ot]
connect_bd_net [get_bd_pins pcie_link_stat/pcie_link_status_info] [get_bd_pins brd_info_regs/pcie_link_status_info]
connect_bd_net [get_bd_pins system_management/alarm_out] [get_bd_ports sys_mon_alarm]
connect_bd_net [get_bd_ports mga] [get_bd_pins axil_i2c_mstr_1/port_mga]
connect_bd_net [get_bd_pins pcie_link_stat/pcie_link_up_led_n] [get_bd_ports pcie_link_up_led_n]
connect_bd_net [get_bd_pins pcie_link_stat/lane_led0_n] [get_bd_ports pcie_lane_led0_n]
connect_bd_net [get_bd_pins pcie_link_stat/lane_led1_n] [get_bd_ports pcie_lane_led1_n]
connect_bd_net [get_bd_pins brd_info_regs/user_led_n] [get_bd_ports user_led_n]
connect_bd_net [get_bd_pins brd_info_regs/sys_mon_led_n] [get_bd_ports sys_mon_led_n]
connect_bd_net -net ext_temp_irq_n_1 [get_bd_ports temp_irq_n] [get_bd_pins brd_info_regs/ext_temp_irq_n]
connect_bd_net [get_bd_pins axil_i2c_mstr_0/irq] [get_bd_pins brd_info_regs/i2c1_irq]
connect_bd_net [get_bd_pins axil_i2c_mstr_1/irq] [get_bd_pins brd_info_regs/i2c2_irq]
connect_bd_net [get_bd_ports rev] [get_bd_pins brd_info_regs/rev]
connect_bd_net [get_bd_ports rev_date] [get_bd_pins brd_info_regs/rev_date]
connect_bd_net [get_bd_ports fpio_type] [get_bd_pins brd_info_regs/fpio]
connect_bd_net [get_bd_pins brd_info_regs/irq] [get_bd_pins xlconcat_0/In0]
connect_bd_net -net timestamp_irq_1 [get_bd_ports time_irq] [get_bd_pins xlconcat_0/In1]
connect_bd_net [get_bd_ports dataio_irq] [get_bd_pins xlconcat_0/In2]
connect_bd_net [get_bd_ports dataiopkt_irq] [get_bd_pins xlconcat_0/In3]
connect_bd_net [get_bd_ports dma_irq] [get_bd_pins xlconcat_0/In4]
connect_bd_net -net ddc_irq_1 [get_bd_ports dsp_irq] [get_bd_pins xlconcat_0/In5]
connect_bd_net -net user_irq_1 [get_bd_ports user1_irq] [get_bd_pins xlconcat_0/In6]
connect_bd_net [get_bd_ports user2_irq] [get_bd_pins xlconcat_0/In7]
connect_bd_net [get_bd_pins xlconcat_0/dout] [get_bd_pins pcie_irq_ctlr/int_in]
connect_bd_net -net px_axil2flash_0_flash_a [get_bd_pins axil2flash/flash_a] [get_bd_ports flash_a]
connect_bd_net -net px_axil2flash_0_flash_adv_b [get_bd_pins axil2flash/flash_adv_b] [get_bd_ports flash_adv_b]
connect_bd_net -net px_axil2flash_0_flash_d_o [get_bd_pins axil2flash/flash_d_o] [get_bd_ports flash_d_o]
connect_bd_net -net px_axil2flash_0_flash_d_t [get_bd_pins axil2flash/flash_d_t] [get_bd_ports flash_d_t]
connect_bd_net -net px_axil2flash_0_flash_fwe_b [get_bd_pins axil2flash/flash_fwe_b] [get_bd_ports flash_fwe_b]
connect_bd_net -net px_axil2flash_0_flash_fcs_b [get_bd_pins axil2flash/flash_fcs_b] [get_bd_ports flash_fcs_b]
connect_bd_net -net px_axil2flash_0_flash_foe_b [get_bd_pins axil2flash/flash_foe_b] [get_bd_ports flash_foe_b]
connect_bd_net [get_bd_ports flash_d_i] [get_bd_pins axil2flash/flash_d_i]
connect_bd_net -net size_1 [get_bd_ports fpga_size] [get_bd_pins brd_info_regs/size]
connect_bd_net [get_bd_pins px_axil_timeout_rst_0/m_axi_aresetn] [get_bd_pins linkup_and/Op2]
connect_bd_net -net util_vector_logic_0_Res [get_bd_pins linkup_and/Res] [get_bd_pins pcie2axil/user_lnk_up]
connect_bd_net [get_bd_pins clk_wiz_0/clk_out1] [get_bd_pins axi_hwicap_0/icap_clk]
connect_bd_net -net eos_in_1 [get_bd_ports startup_eos_in] [get_bd_pins axi_hwicap_0/eos_in]

# ---- address map ----
assign_bd_address -offset 0x0000000 -range 4K -target_address_space [get_bd_addr_spaces axil_byteswap/m_axi] [get_bd_addr_segs brd_info_regs/s_axi_csr/reg0]
assign_bd_address -offset 0x0001000 -range 4K -target_address_space [get_bd_addr_spaces axil_byteswap/m_axi] [get_bd_addr_segs pcie_irq_ctlr/s_axi/reg0]
assign_bd_address -offset 0x0002000 -range 4K -target_address_space [get_bd_addr_spaces axil_byteswap/m_axi] [get_bd_addr_segs rq_traffic_meter/s_axi_csr/reg0]
assign_bd_address -offset 0x0003000 -range 4K -target_address_space [get_bd_addr_spaces axil_byteswap/m_axi] [get_bd_addr_segs rc_traffic_meter/s_axi_csr/reg0]
assign_bd_address -offset 0x0004000 -range 4K -target_address_space [get_bd_addr_spaces axil_byteswap/m_axi] [get_bd_addr_segs system_management/S_AXI_LITE/Reg]
assign_bd_address -offset 0x0005000 -range 4K -target_address_space [get_bd_addr_spaces axil_byteswap/m_axi] [get_bd_addr_segs axil2flash/s_axi/reg0]
assign_bd_address -offset 0x0006000 -range 4K -target_address_space [get_bd_addr_spaces axil_byteswap/m_axi] [get_bd_addr_segs axil2ddr/s_axi/reg0]
assign_bd_address -offset 0x0007000 -range 4K -target_address_space [get_bd_addr_spaces axil_byteswap/m_axi] [get_bd_addr_segs m_axi_ddr4_csr/Reg]
assign_bd_address -offset 0x0008000 -range 4K -target_address_space [get_bd_addr_spaces axil_byteswap/m_axi] [get_bd_addr_segs axil_i2c_mstr_0/s_axi_csr/reg0]
assign_bd_address -offset 0x0009000 -range 4K -target_address_space [get_bd_addr_spaces axil_byteswap/m_axi] [get_bd_addr_segs axil_i2c_mstr_1/s_axi_csr/reg0]
assign_bd_address -offset 0x000A000 -range 4K -target_address_space [get_bd_addr_spaces axil_byteswap/m_axi] [get_bd_addr_segs axi_hwicap_0/S_AXI_LITE/Reg]
assign_bd_address -offset 0x0800000 -range 8M -target_address_space [get_bd_addr_spaces axil_byteswap/m_axi] [get_bd_addr_segs m_axi_acq_csr/Reg]
assign_bd_address -offset 0x1000000 -range 16M -target_address_space [get_bd_addr_spaces axil_byteswap/m_axi] [get_bd_addr_segs m_axi_dataio_csr/Reg]
assign_bd_address -offset 0x2000000 -range 16M -target_address_space [get_bd_addr_spaces axil_byteswap/m_axi] [get_bd_addr_segs m_axi_dsp_csr/Reg]
assign_bd_address -offset 0x3000000 -range 8M -target_address_space [get_bd_addr_spaces axil_byteswap/m_axi] [get_bd_addr_segs m_axi_user1_csr/Reg]
assign_bd_address -offset 0x3800000 -range 8M -target_address_space [get_bd_addr_spaces axil_byteswap/m_axi] [get_bd_addr_segs m_axi_user2_csr/Reg]
assign_bd_address -offset 0x0000000 -range 64M -target_address_space [get_bd_addr_spaces pcie2axil/m_axi] [get_bd_addr_segs px_axil_timeout_rst_0/s_axi/reg0]
assign_bd_address -offset 0x0000000 -range 64M -target_address_space [get_bd_addr_spaces px_axil_timeout_rst_0/m_axi] [get_bd_addr_segs axil_byteswap/s_axi/reg0]

validate_bd_design
save_bd_design
